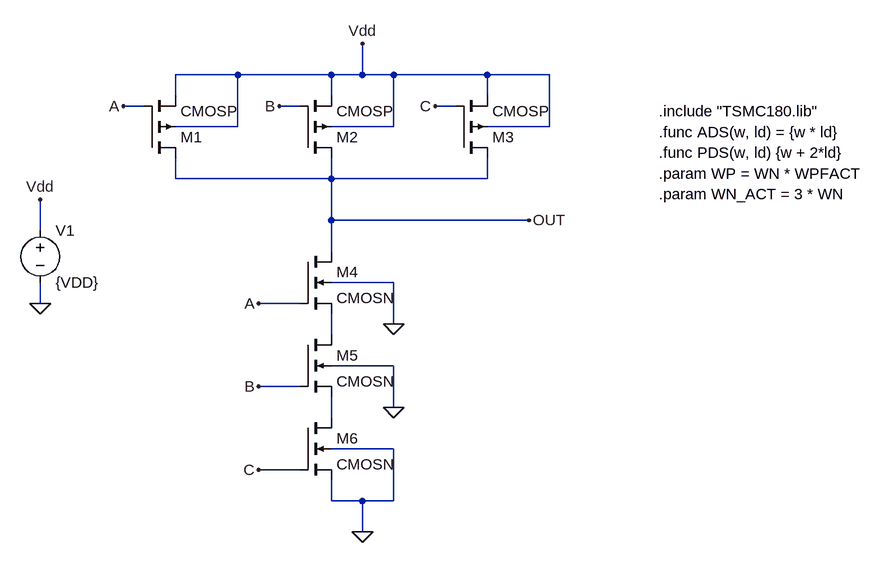
[diagram p0: schematic nand3.asc]
nand3.asc, the LTspice schematic file:
Version 4
SHEET 1 1180 708
WIRE -112 -16 -208 -16
WIRE 32 -16 -112 -16
WIRE 80 -16 80 -64
WIRE 80 -16 32 -16
WIRE 128 -16 80 -16
WIRE 272 -16 128 -16
WIRE 368 -16 272 -16
WIRE -208 16 -208 -16
WIRE 32 16 32 -16
WIRE 272 16 272 -16
WIRE -256 32 -288 32
WIRE -16 32 -48 32
WIRE 224 32 192 32
WIRE -112 64 -112 -16
WIRE -112 64 -208 64
WIRE 128 64 128 -16
WIRE 128 64 32 64
WIRE 368 64 368 -16
WIRE 368 64 272 64
WIRE -208 144 -208 112
WIRE 32 144 32 112
WIRE 32 144 -208 144
WIRE 272 144 272 112
WIRE 272 144 32 144
WIRE 32 208 32 144
WIRE 336 208 32 208
WIRE -416 224 -416 176
WIRE 32 256 32 208
WIRE 128 304 32 304
WIRE -416 336 -416 304
WIRE -16 336 -80 336
WIRE 128 368 128 304
WIRE 32 384 32 352
WIRE 128 432 32 432
WIRE -16 464 -80 464
WIRE 128 496 128 432
WIRE 32 512 32 480
WIRE 128 560 32 560
WIRE -16 592 -80 592
WIRE 32 640 32 608
WIRE 80 640 32 640
WIRE 128 640 128 560
WIRE 128 640 80 640
WIRE 80 688 80 640
FLAG -416 176 Vdd
FLAG -416 336 0
FLAG 80 -64 Vdd
FLAG -288 32 A
FLAG -80 336 A
FLAG -48 32 B
FLAG -80 464 B
FLAG 336 208 OUT
FLAG 128 368 0
FLAG 192 32 C
FLAG 128 496 0
FLAG -80 592 C
FLAG 80 688 0
SYMBOL nmos4 -16 256 R0
SYMATTR InstName M4
SYMATTR Value CMOSN
SYMATTR Value2 l={L} w={WN_ACT} ad={ADS(WN_ACT,LD)} as={ADS(WN_ACT,LD)} pd={PDS(WN_ACT,LD)} ps={PDS(WN_ACT,LD)}
SYMBOL pmos4 -16 112 M180
SYMATTR InstName M2
SYMATTR Value CMOSP
SYMATTR Value2 l={L} w={WP} ad={ADS(WP,LD)} as={ADS(WP,LD)} pd={PDS(WP,LD)} ps={PDS(WP,LD)}
SYMBOL voltage -416 208 R0
WINDOW 123 0 0 Left 0
WINDOW 39 0 0 Left 0
SYMATTR InstName V1
SYMATTR Value {VDD}
SYMBOL pmos4 -256 112 M180
SYMATTR InstName M1
SYMATTR Value CMOSP
SYMATTR Value2 l={L} w={WP} ad={ADS(WP,LD)} as={ADS(WP,LD)} pd={PDS(WP,LD)} ps={PDS(WP,LD)}
SYMBOL pmos4 224 112 M180
SYMATTR InstName M3
SYMATTR Value CMOSP
SYMATTR Value2 l={L} w={WP} ad={ADS(WP,LD)} as={ADS(WP,LD)} pd={PDS(WP,LD)} ps={PDS(WP,LD)}
SYMBOL nmos4 -16 384 R0
SYMATTR InstName M5
SYMATTR Value CMOSN
SYMATTR Value2 l={L} w={WN_ACT} ad={ADS(WN_ACT,LD)} as={ADS(WN_ACT,LD)} pd={PDS(WN_ACT,LD)} ps={PDS(WN_ACT,LD)}
SYMBOL nmos4 -16 512 R0
SYMATTR InstName M6
SYMATTR Value CMOSN
SYMATTR Value2 l={L} w={WN_ACT} ad={ADS(WN_ACT,LD)} as={ADS(WN_ACT,LD)} pd={PDS(WN_ACT,LD)} ps={PDS(WN_ACT,LD)}
TEXT 536 136 Left 2 !.param WP = WN * WPFACT
TEXT 536 40 Left 2 !.include "TSMC180.lib"
TEXT 536 72 Left 2 !.func ADS(w, ld) = {w * ld}
TEXT 536 104 Left 2 !.func PDS(w, ld) {w + 2*ld}
TEXT 536 168 Left 2 !.param WN_ACT = 3 * WN

The netlist it stands for:
* nand3.asc
M4 OUT A N001 0 CMOSN l={L} w={WN_ACT} ad={ADS(WN_ACT,LD)} as={ADS(WN_ACT,LD)} pd={PDS(WN_ACT,LD)} ps={PDS(WN_ACT,LD)}
M2 OUT B Vdd Vdd CMOSP l={L} w={WP} ad={ADS(WP,LD)} as={ADS(WP,LD)} pd={PDS(WP,LD)} ps={PDS(WP,LD)}
V1 Vdd 0 {VDD}
M1 OUT A Vdd Vdd CMOSP l={L} w={WP} ad={ADS(WP,LD)} as={ADS(WP,LD)} pd={PDS(WP,LD)} ps={PDS(WP,LD)}
M3 OUT C Vdd Vdd CMOSP l={L} w={WP} ad={ADS(WP,LD)} as={ADS(WP,LD)} pd={PDS(WP,LD)} ps={PDS(WP,LD)}
M5 N001 B N002 0 CMOSN l={L} w={WN_ACT} ad={ADS(WN_ACT,LD)} as={ADS(WN_ACT,LD)} pd={PDS(WN_ACT,LD)} ps={PDS(WN_ACT,LD)}
M6 N002 C 0 0 CMOSN l={L} w={WN_ACT} ad={ADS(WN_ACT,LD)} as={ADS(WN_ACT,LD)} pd={PDS(WN_ACT,LD)} ps={PDS(WN_ACT,LD)}
.model NMOS NMOS
.model PMOS PMOS
.lib standard.mos
.param WP = WN * WPFACT
.include "TSMC180.lib"
.func ADS(w, ld) = {w * ld}
.func PDS(w, ld) {w + 2*ld}
.param WN_ACT = 3 * WN
.backanno
.end